# Altium schematic sheet USB-C - Serial Bridge.SchDoc
size A4; SheetNumber: 5; SheetTotal: 6
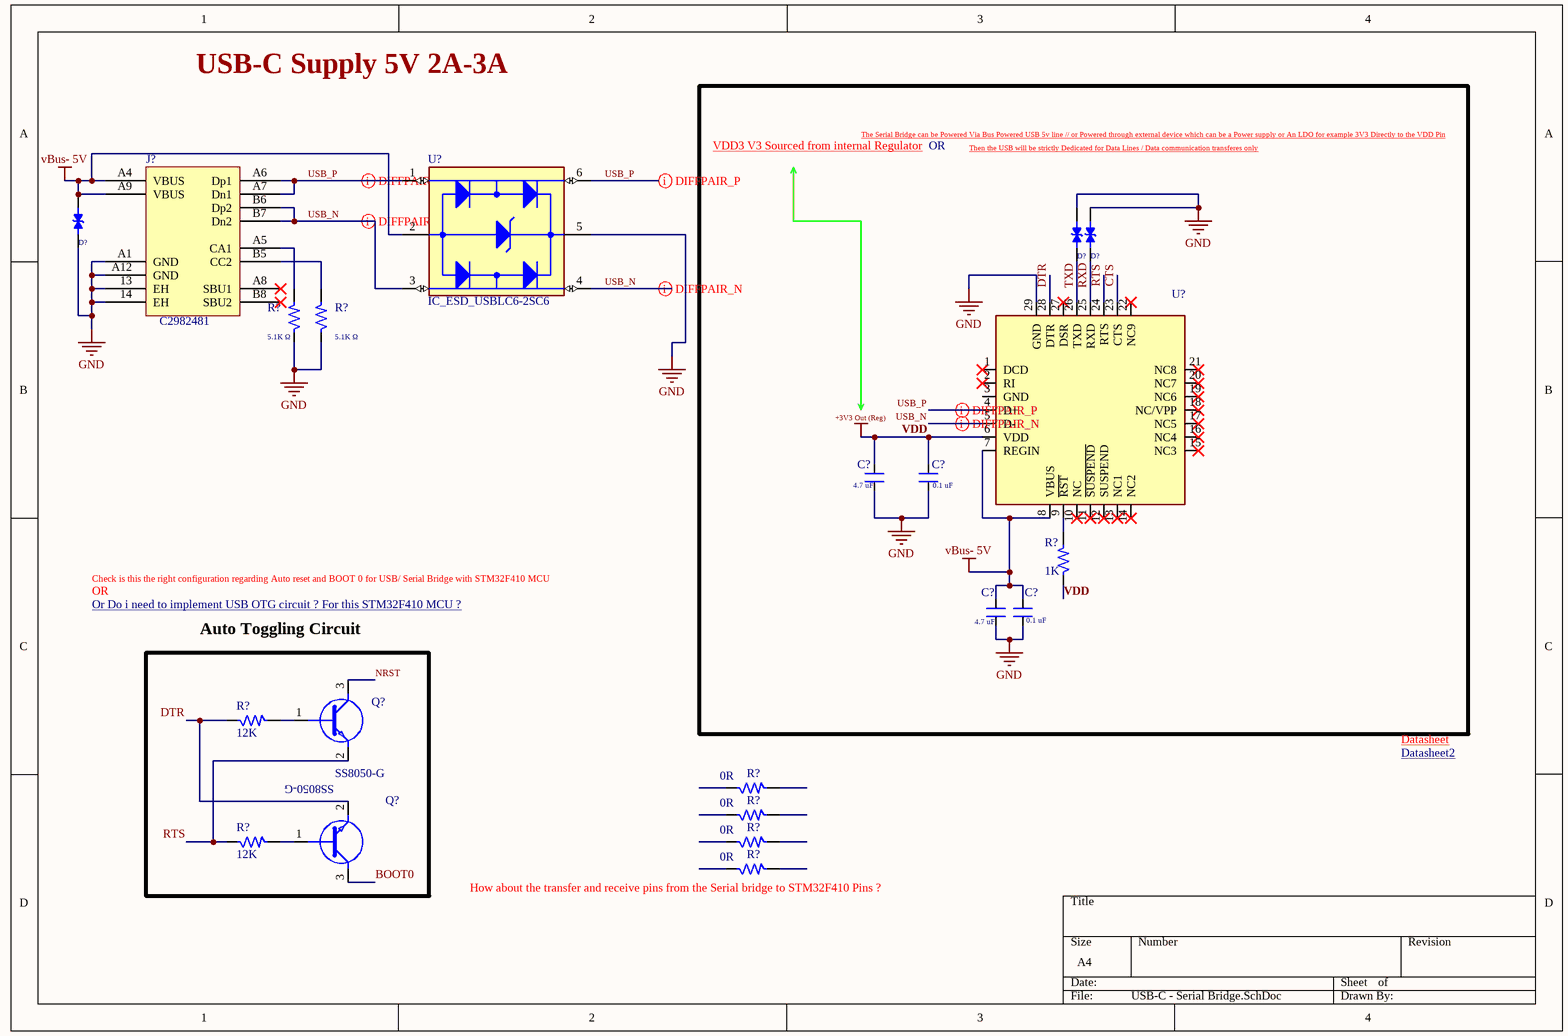
[diagram p0: USB-C - Serial Bridge.SchDoc]

## Parts
(Parts that share a designator on the sheet are numbered #1, #2 ... from top to bottom, then left to right.)
C?#1  4.7 uF  [RES_0603]
C?#2  0.1 uF  [RES_0603]
C?#3  4.7 uF  [RES_0603]
C?#4  0.1 uF  [RES_0603]
D?#1  LESD5D5.0CT1G  [LESD5D5.0CT1G]  (value not drawn)
D?#2  LESD5D5.0CT1G  [LESD5D5.0CT1G]  (value not drawn)
D?#3  LESD5D5.0CT1G  [LESD5D5.0CT1G]  (value not drawn)
J?  C2982481  [GT-USB-7079A]
Q?#1  SS8050-G  [BJT_NPN_SS8050-G]  (value not drawn)
Q?#2  SS8050-G  [BJT_NPN_SS8050-G]  (value not drawn)
R?#1  5.1K Ω  [RES_0603]
R?#2  5.1K Ω  [RES_0603]
R?#3  1K  [RES_0603]
R?#4  12K  [RES_0805]
R?#5  0R  [RES_0805]
R?#6  0R  [RES_0805]
R?#7  12K  [RES_0805]
R?#8  0R  [RES_0805]
R?#9  0R  [RES_0805]
U?#1  IC_ESD_USBLC6-2SC6  [USB-ESD-SOT95P280X145-6N]
U?#2  CP2102-GMR-QFN-28  [CP2102-GMR-USB-UART]  (value not drawn)

## Blocks framed on the sheet
Auto Toggling Circuit: Q?#1 Q?#2 R?#4 R?#7

## Nets
GND: C?#1.1 C?#2.1 C?#3.1 C?#4.1 D?#1.1 D?#2.2 D?#3.2 J?.13(EH) J?.14(EH) J?.A1(GND) J?.A12(GND) R?#1.1 R?#2.1 U?#1.5(VBUS) U?#2.29(GND)
vBus- 5V: C?#3.2 C?#4.2 D?#1.2 J?.A4(VBUS) J?.A9(VBUS) U?#1.2(GND) U?#2.7(REGIN) U?#2.8(VBUS)
VDD: C?#1.2 C?#2.2 R?#3.1 U?#2.6(VDD)  [also labelled +3V3 Out (Reg)]
BOOT0: Q?#2.3(C)
CTS: U?#2.23(CTS)
DTR: Q?#2.2(E) R?#4.1 U?#2.28(DTR)
NRST: Q?#1.3(C)
RTS: Q?#1.2(E) R?#7.1 U?#2.24(RTS)
RXD: D?#3.1 U?#2.25(RXD)
TXD: D?#2.1 U?#2.26(TXD)
USB_N: J?.B6(Dp2) J?.B7(Dn2) U?#1.3(I/O2_IN) U?#1.4(I/O2_OUT) U?#2.5(D-)
USB_P: J?.A6(Dp1) J?.A7(Dn1) U?#1.1(I/O1_IN) U?#1.6(I/O1_OUT) U?#2.4(D+)
NetJ?_A5: J?.A5(CA1) R?#1.2
NetJ?_B5: J?.B5(CC2) R?#2.2
NetQ?#1_1: Q?#1.1(B) R?#4.2
NetQ?#2_1: Q?#2.1(B) R?#7.2
NetR?#3_2: R?#3.2 U?#2.9(~{RST})

Not connected (* = marked no-connect by the designer): J? A8(SBU1)* B8(SBU2)*; R?#5 1 2; R?#6 1 2; R?#8 1 2; R?#9 1 2; U?#2 1(DCD)* 2(RI)* 3(GND) 10(NC)* 11(~{SUSPEND})* 12(SUSPEND)* 13(NC1)* 14(NC2)* 15(NC3)* 16(NC4)* 17(NC5)* 18(NC/VPP)* 19(NC6)* 20(NC7)* 21(NC8)* 22(NC9)* 27(DSR)*

## Layout directives
differential pair: USB_N, USB_P

## Notes on the sheet
- USB-C Supply 5V 2A-3A
- VDD3 V3 Sourced from internal Regulator
- The Serial Bridge can be Powered Via Bus Powered USB 5v line // or Powered through external device which can be a Power supply or An LDO for example 3V3 Directly to the VDD Pin
- OR
- Then the USB will be strictly Dedicated for Data Lines / Data communication transferes only
- Check is this the right configuration regarding Auto reset and BOOT 0 for USB/ Serial Bridge with STM32F410 MCU
- Or Do i need to implement USB OTG circuit ? For this STM32F410 MCU ? <https://www.google.com/search?q=USB+OTG+schematic+&sca_esv=7f9c333ee08b39a1&rlz=1C1ONGR_en-GBAU1190AU1192&udm=2&biw=1920&bih=945&sxsrf=AE3TifOh7c1v_j3b8hJNrGHXpSCEWAvt7A%3A1765691483216&ei=W1A-aa76DJC2vr0PnabzQA&ved=0ahUKEwjuk4-tsbyRAxUQm68BHR3THAgQ4dUDCBE&uact=5&oq=USB+OTG+schematic+&gs_lp=Egtnd3Mtd2l6LWltZyISVVNCIE9URyBzY2hlbWF0aWMgMgQQABgeMgYQABgFGB4yBhAAGAUYHjIGEAAYBRgeMgYQABgIGB4yBhAAGAgYHjIGEAAYCBgeMgYQABgIGB4yBhAAGAgYHjIIEAAYCBgKGB5I7UNQ5g1YgTlwBHgAkAEAmAHfAaABsBKqAQYwLjEzLjG4AQPIAQD4AQGYAg-gArcQwgIKEAAYgAQYQxiKBcICBhAAGAcYHsICBRAAGIAEwgIIEAAYBRgKGB6YAwCIBgGSBwYzLjExLjGgB_tKsgcGMC4xMS4xuAeoEMIHBjAuMS4xNMgHOoAIAA&sclient=gws-wiz-img#sv=CAMSVhoyKhBlLUxEYldTc2dTckVhZktNMg5MRGJXU3NnU3JFYWZLTToOZDJjSmpfYUFYS19WeE0gBCocCgZtb3NhaWMSEGUtTERiV1NzZ1NyRWFmS00YADABGAcgko3WwQcwAkoKCAIQAhgCIAIoAg>
- Datasheet <https://cdn.sparkfun.com/assets/c/7/7/b/f/cp2102.pdf>
- Datasheet2 <https://www.silabs.com/documents/public/data-sheets/CP2102-9.pdf>
- (near R?#9) How about the transfer and receive pins from the Serial bridge to STM32F410 Pins ?

## Library data of the parts
C?#1-C?#4 = CAP_GENERIC_0603_1: Ceramic Capacitor C0G, NP0 0603 (2012 Metric); Manufacturer: Yageo; Manufacturer Part Number: 600F1R0BT250XT; Alternate Part Number-1: NA; Case/Package: 0805; Supplier-1: Mouser; Supplier Part Number-1: 581-600F1R0BT
D?#1-D?#3 = DIO_Transient_VOl_Suppressor_ESD_PROTECTION: Transient Voltage Suppressors for ESD Protection
J? = CON_USB-C_GT-USB-7079A: 5A 1 Surface Mount 16 Female -55℃~+85℃ Type-C SMD USB Connectors ROHS C2982481
Q?#1 Q?#2 = BJT_SS8050-G_NPN: Bipolar Transistors - BJT NPN TRANSISTOR 1.5A 40V
R?#1 R?#2 = RES_82K-0.1W-1%-0603: 82 kOhms ±1% 0.125W, 1/8W Chip Resistor 0603 (1608 Metric) Anti-Sulfur Thin Film; Manufacturer: Vishay Beyschlag; Manufacturer Part Number: MCT06030C8202FP500; Alternate Part Number-1: NA; Case/Package: 0603; Supplier-1: SIRICOM; Supplier Part Number-1: NA
R?#3 = RES_1K-0.1W-1%-0603: 1 kOhms ±1% 0.1W, 1/10W Chip Resistor 0603 (1608 Metric) Automotive AEC-Q200 Thick Film; Manufacturer: Walsin; Manufacturer Part Number: WR06X1001FTL; Alternate Part Number-1: 0603WAF1001T5E; Case/Package: 0603; Supplier-1: SIRICOM; Supplier Part Number-1: WR06X1001FTL
R?#4 R?#7 = RES_13K-0.125W-1%-0805: 13 kOhms ±1% 0.125W, 1/8W Chip Resistor 0805 (2012 Metric) Thick Film; Manufacturer: TE Connectivity Passive Product; Manufacturer Part NUMMBER: CRG0805F13K; Manufacturer Part Number: NA; Case/Package: 0805; Supplier-1: Siricom; Supplier Part Number-1: NA; Alternate Part Number-1: NA
R?#5 R?#6 R?#8 R?#9 = RES_0R-0.125W-1%-0805: 0 Ohms Jumper 0.125W, 1/8W Chip Resistor 0805 (2012 Metric) Automotive AEC-Q200 Thick Film; Manufacturer: Walsin; Manufacturer Part Number: WR08X000PTL; Case/Package: 0805; Supplier-1: SIRICOM; Supplier Part Number-1: WR08X000PTL; Alternate Part Number-1: WR08X000PTL
U?#1 = IC_ESD_USBLC6-2SC6: 17V Clamp 5A (8/20Âµs) Ipp Tvs Diode Surface Mount SOT-23-6; MF: STMicroelectronics; Value: *; SnapEDA_Link: https://www.snapeda.com/parts/USBLC6-2SC6/STMicroelectronics/view-part/?ref=snap; Check_prices: https://www.snapeda.com/parts/USBLC6-2SC6/STMicroelectronics/view-part/?ref=eda; Purchase-URL: https://pricing.snapeda.com/search/part/USBLC6-2SC6/?ref=eda; Price: None; Availability: In Stock; Package: SOT-23-6 STMicroelectronics; MP: USBLC6-2SC6
U?#2 = Serial-Bridge-INTERFACE-CP2102-GMR(QFN28): USB Bridge, USB to UART USB 2.0 UART Interface 28-QFN (5x5)